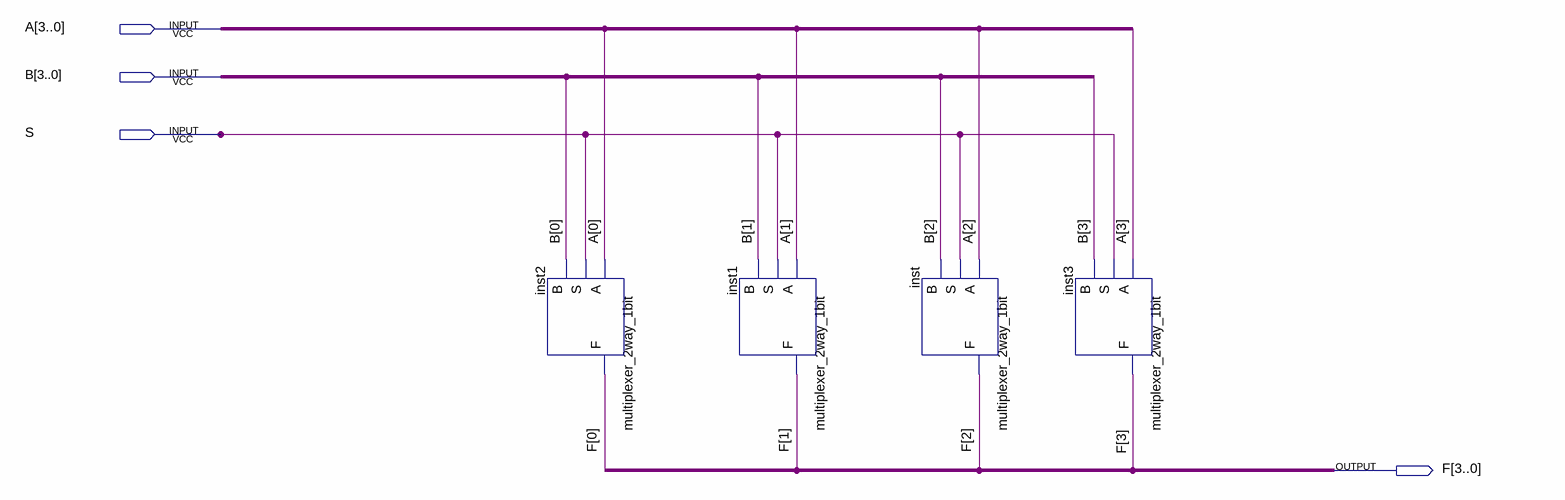
[diagram p0: schematic sheet]
// Quartus schematic multiplexer_2way_4bit.bdf as structural Verilog: 4 symbols, 4 pins
module multiplexer_2way_4bit (
  input  [3:0] A,
  input  [3:0] B,
  input  S,
  output [3:0] F
);

  multiplexer_2way_1bit inst2 (.A(A[0]), .S(S), .B(B[0]), .F(F[0]));
  multiplexer_2way_1bit inst1 (.A(A[1]), .S(S), .B(B[1]), .F(F[1]));
  multiplexer_2way_1bit inst (.A(A[2]), .S(S), .B(B[2]), .F(F[2]));
  multiplexer_2way_1bit inst3 (.A(A[3]), .S(S), .B(B[3]), .F(F[3]));
endmodule
